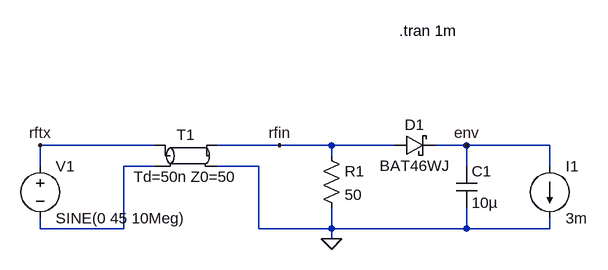
[diagram p0: schematic peak_detector_txline.asc]
peak_detector_txline.asc, the LTspice schematic file:
Version 4
SHEET 1 880 680
WIRE 64 96 -112 96
WIRE 256 96 160 96
WIRE 336 96 256 96
WIRE 432 96 336 96
WIRE 544 96 496 96
WIRE 672 96 544 96
WIRE 336 112 336 96
WIRE -112 128 -112 96
WIRE 64 128 16 128
WIRE 224 128 160 128
WIRE 544 128 544 96
WIRE 672 128 672 96
WIRE -112 224 -112 208
WIRE 16 224 16 128
WIRE 16 224 -112 224
WIRE 224 224 224 128
WIRE 336 224 336 192
WIRE 336 224 224 224
WIRE 544 224 544 192
WIRE 544 224 336 224
WIRE 672 224 672 208
WIRE 672 224 544 224
WIRE 336 240 336 224
FLAG 336 240 0
FLAG -112 96 rftx
FLAG 256 96 rfin
FLAG 544 96 env
SYMBOL tline 112 112 R0
SYMATTR InstName T1
SYMBOL voltage -112 112 R0
WINDOW 123 0 0 Left 0
WINDOW 39 0 0 Left 0
SYMATTR InstName V1
SYMATTR Value SINE(0 45 10Meg)
SYMBOL res 320 96 R0
SYMATTR InstName R1
SYMATTR Value 50
SYMBOL schottky 432 112 R270
WINDOW 0 32 32 VTop 2
WINDOW 3 0 32 VBottom 2
SYMATTR InstName D1
SYMATTR Value BAT46WJ
SYMATTR Description Diode
SYMATTR Type diode
SYMBOL cap 528 128 R0
SYMATTR InstName C1
SYMATTR Value 10µ
SYMBOL current 672 128 R0
WINDOW 123 0 0 Left 0
WINDOW 39 0 0 Left 0
SYMATTR InstName I1
SYMATTR Value 3m
TEXT 440 -80 Left 2 !.tran 1m

The netlist it stands for:
* peak_detector_txline.asc
T1 rftx N001 rfin 0 Td=50n Z0=50
V1 rftx N001 SINE(0 45 10Meg)
R1 rfin 0 50
D1 rfin env BAT46WJ
C1 env 0 10µ
I1 env 0 3m
.model D D
.lib standard.dio
.tran 1m
.backanno
.end